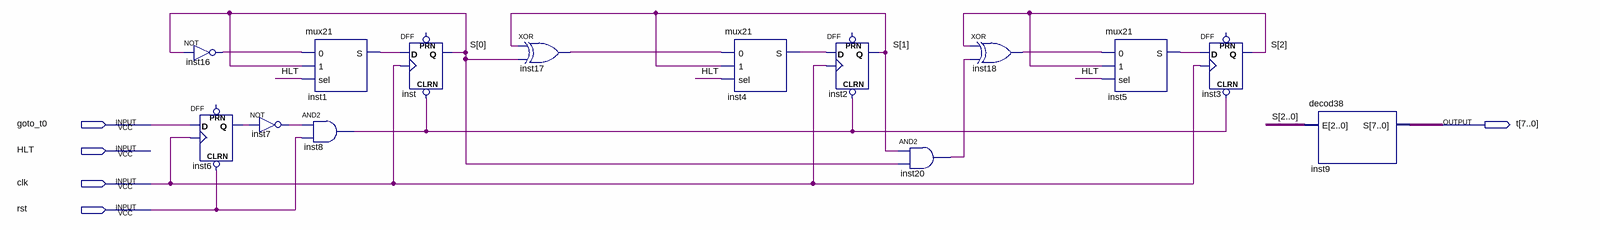
[diagram p0: schematic sheet]
// Quartus schematic temporizer2.bdf as structural Verilog: 14 symbols, 5 pins
module temporizer2 (
  input  goto_t0,
  input  HLT,
  input  clk,
  input  rst,
  output [7:0] t
);

  wire inst1_s, inst4_s, inst5_s, inst6_q, inst7_out, inst8_out, inst16_out, inst17_out, inst18_out,
       inst20_out;
  wire [2:0] S;

  not inst16 (inst16_out, S[0]);
  DFF inst6 (.CLRN(rst), .CLK(clk), .D(goto_t0), .Q(inst6_q));  // open: PRN
  not inst7 (inst7_out, inst6_q);
  mux21 inst1 (.\0 (inst16_out), .\1 (S[0]), .sel(HLT), .S(inst1_s));
  and inst8 (inst8_out, inst7_out, rst);
  DFF inst (.CLRN(inst8_out), .CLK(clk), .D(inst1_s), .Q(S[0]));  // open: PRN
  xor inst17 (inst17_out, S[1], S[0]);
  mux21 inst4 (.\0 (inst17_out), .\1 (S[1]), .sel(HLT), .S(inst4_s));
  DFF inst2 (.CLRN(inst8_out), .CLK(clk), .D(inst4_s), .Q(S[1]));  // open: PRN
  and inst20 (inst20_out, S[1], S[0]);
  xor inst18 (inst18_out, S[2], inst20_out);
  mux21 inst5 (.\0 (inst18_out), .\1 (S[2]), .sel(HLT), .S(inst5_s));
  DFF inst3 (.CLRN(inst8_out), .CLK(clk), .D(inst5_s), .Q(S[2]));  // open: PRN
  decod38 inst9 (.E(S), .S(t));
endmodule
